# Altium schematic sheet TopLevel.SchDoc
size A4; SheetNumber: 1; SheetTotal: 6
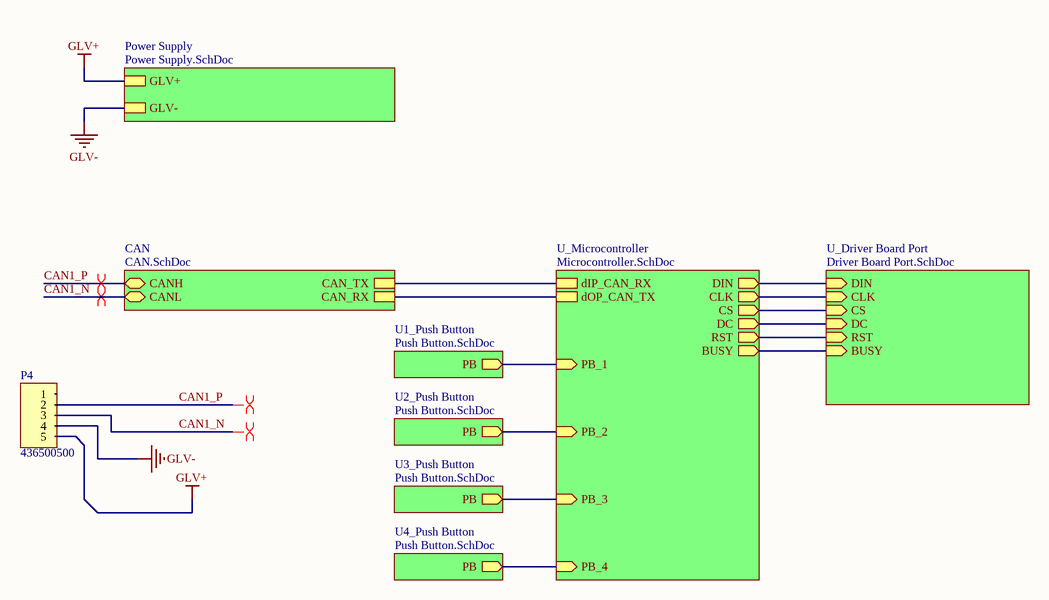
[diagram p0: TopLevel.SchDoc]

## Parts
P4  436500500  [436500500]

## Sub-sheets
CAN = CAN.SchDoc: CANH (bidir), CANL (bidir), CAN_TX, CAN_RX
Power Supply = Power Supply.SchDoc: GLV+, GLV-
U1_Push Button = Push Button.SchDoc: PB (out)
U2_Push Button = Push Button.SchDoc: PB (out)
U3_Push Button = Push Button.SchDoc: PB (out)
U4_Push Button = Push Button.SchDoc: PB (out)
U_Driver Board Port = Driver Board Port.SchDoc: DIN (in), CLK (in), CS (in), DC (in), RST (in), BUSY (in)
U_Microcontroller = Microcontroller.SchDoc: dIP_CAN_RX, dOP_CAN_TX, DIN (out), CLK (out), CS (out), PB_2 (in), PB_1 (in), BUSY (out), DC (out), RST (out), PB_4 (in), PB_3 (in)

## Nets
GLV+: P4.5 ; sheet Power Supply/GLV+
GLV-: P4.4 ; sheet Power Supply/GLV-
CAN1_N: P4.3 ; sheet CAN/CANL
CAN1_P: P4.2 ; sheet CAN/CANH
(unnamed): sheet CAN/CAN_TX, sheet U_Microcontroller/dIP_CAN_RX
(unnamed): sheet CAN/CAN_RX, sheet U_Microcontroller/dOP_CAN_TX
(unnamed): sheet U_Microcontroller/DIN, sheet U_Driver Board Port/DIN
(unnamed): sheet U_Microcontroller/CLK, sheet U_Driver Board Port/CLK
(unnamed): sheet U_Microcontroller/CS, sheet U_Driver Board Port/CS
(unnamed): sheet U_Microcontroller/PB_2, sheet U2_Push Button/PB
(unnamed): sheet U_Microcontroller/PB_1, sheet U1_Push Button/PB
(unnamed): sheet U_Microcontroller/BUSY, sheet U_Driver Board Port/BUSY
(unnamed): sheet U_Microcontroller/DC, sheet U_Driver Board Port/DC
(unnamed): sheet U_Microcontroller/RST, sheet U_Driver Board Port/RST
(unnamed): sheet U_Microcontroller/PB_4, sheet U4_Push Button/PB
(unnamed): sheet U_Microcontroller/PB_3, sheet U3_Push Button/PB

Not connected (* = marked no-connect by the designer): P4 1

## Layout directives
differential pair: CAN1_N, CAN1_P

## Library data of the parts
P4 = 436500500: Micro-Fit 5x1; Positions: 5; Pitch: 3.0mm; Angle: 90; Flange: No; Contact: Tin; Part Number: 436500500; Row Spacing: 3.0mm; Digikey Part Number: WM1863-ND; Digikey Link: https://www.digikey.com.au/en/products/detail/molex/0436500500/268992